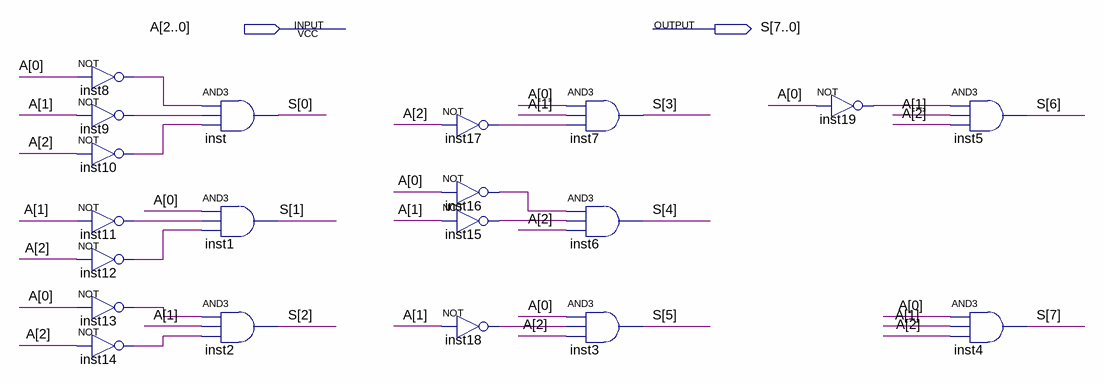
[diagram p0: schematic sheet]
// Quartus schematic decoder_3_8.bdf as structural Verilog: 20 symbols, 2 pins
module decoder_3_8 (
  input  [2:0] A,
  output [7:0] S
);

  wire inst8_out, inst9_out, inst10_out, inst11_out, inst12_out, inst13_out, inst14_out, inst15_out,
       inst16_out, inst17_out, inst18_out, inst19_out;

  not inst8 (inst8_out, A[0]);
  not inst9 (inst9_out, A[1]);
  not inst10 (inst10_out, A[2]);
  not inst11 (inst11_out, A[1]);
  not inst12 (inst12_out, A[2]);
  not inst13 (inst13_out, A[0]);
  not inst14 (inst14_out, A[2]);
  and inst (S[0], inst8_out, inst9_out, inst10_out);
  and inst1 (S[1], A[0], inst11_out, inst12_out);
  and inst2 (S[2], inst13_out, A[1], inst14_out);
  not inst17 (inst17_out, A[2]);
  not inst16 (inst16_out, A[0]);
  not inst15 (inst15_out, A[1]);
  not inst18 (inst18_out, A[1]);
  and inst7 (S[3], A[0], A[1], inst17_out);
  and inst6 (S[4], inst16_out, inst15_out, A[2]);
  and inst3 (S[5], A[0], inst18_out, A[2]);
  not inst19 (inst19_out, A[0]);
  and inst5 (S[6], inst19_out, A[1], A[2]);
  and inst4 (S[7], A[0], A[1], A[2]);
endmodule
